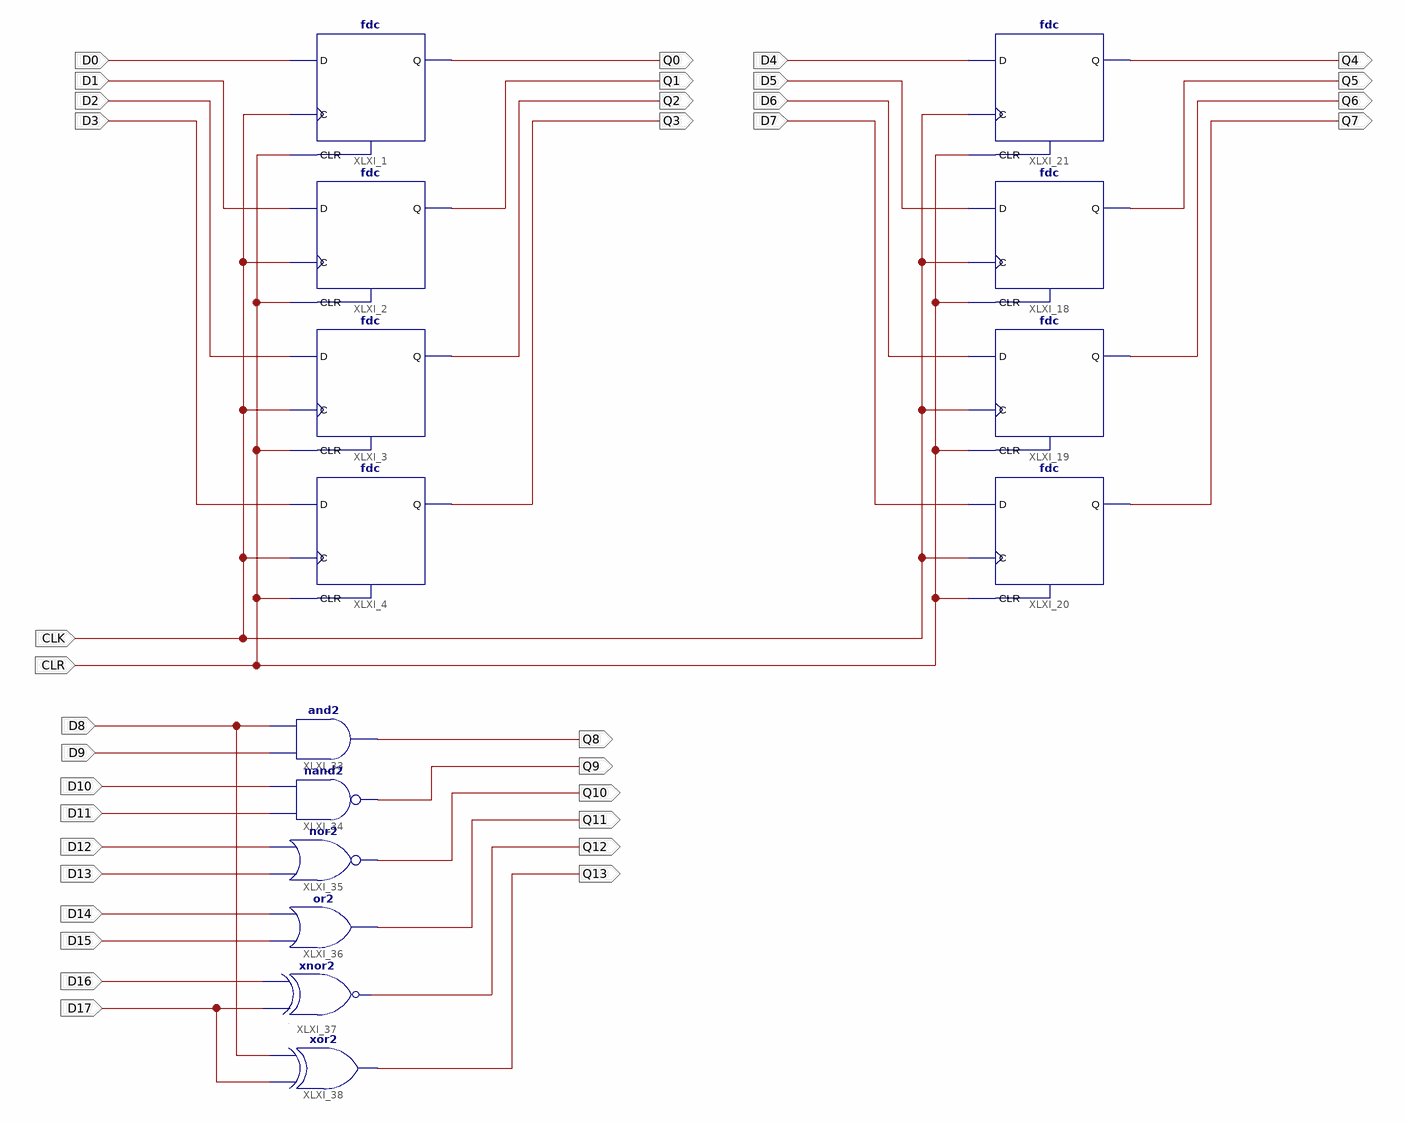
[diagram p0: schematic sheet 1]
// Xilinx ISE schematic Robot_V1.sch (xc9500xl) as structural Verilog: 14 symbols, 34 ports
module Robot_V1 (
  input  D0,
  input  D1,
  input  D2,
  input  D3,
  input  CLK,
  input  CLR,
  input  D4,
  input  D5,
  input  D6,
  input  D7,
  input  D9,
  input  D10,
  input  D8,
  input  D11,
  input  D12,
  input  D13,
  input  D14,
  input  D15,
  input  D16,
  input  D17,
  output Q0,
  output Q3,
  output Q2,
  output Q1,
  output Q4,
  output Q7,
  output Q6,
  output Q5,
  output Q8,
  output Q9,
  output Q10,
  output Q12,
  output Q13,
  output Q11
);

  fdc XLXI_2 (.C(CLK), .CLR(CLR), .D(D1), .Q(Q1));
  fdc XLXI_3 (.C(CLK), .CLR(CLR), .D(D2), .Q(Q2));
  fdc XLXI_4 (.C(CLK), .CLR(CLR), .D(D3), .Q(Q3));
  fdc XLXI_1 (.C(CLK), .CLR(CLR), .D(D0), .Q(Q0));
  fdc XLXI_18 (.C(CLK), .CLR(CLR), .D(D5), .Q(Q5));
  fdc XLXI_19 (.C(CLK), .CLR(CLR), .D(D6), .Q(Q6));
  fdc XLXI_20 (.C(CLK), .CLR(CLR), .D(D7), .Q(Q7));
  fdc XLXI_21 (.C(CLK), .CLR(CLR), .D(D4), .Q(Q4));
  and XLXI_33 (Q8, D9, D8);
  nand XLXI_34 (Q9, D11, D10);
  nor XLXI_35 (Q10, D13, D12);
  or XLXI_36 (Q11, D15, D14);
  xnor XLXI_37 (Q12, D17, D16);
  xor XLXI_38 (Q13, D17, D8);
endmodule
